# EAGLE design nix3PowerFinal (EAGLE 9.2.2)

## Sheet 1 of 2
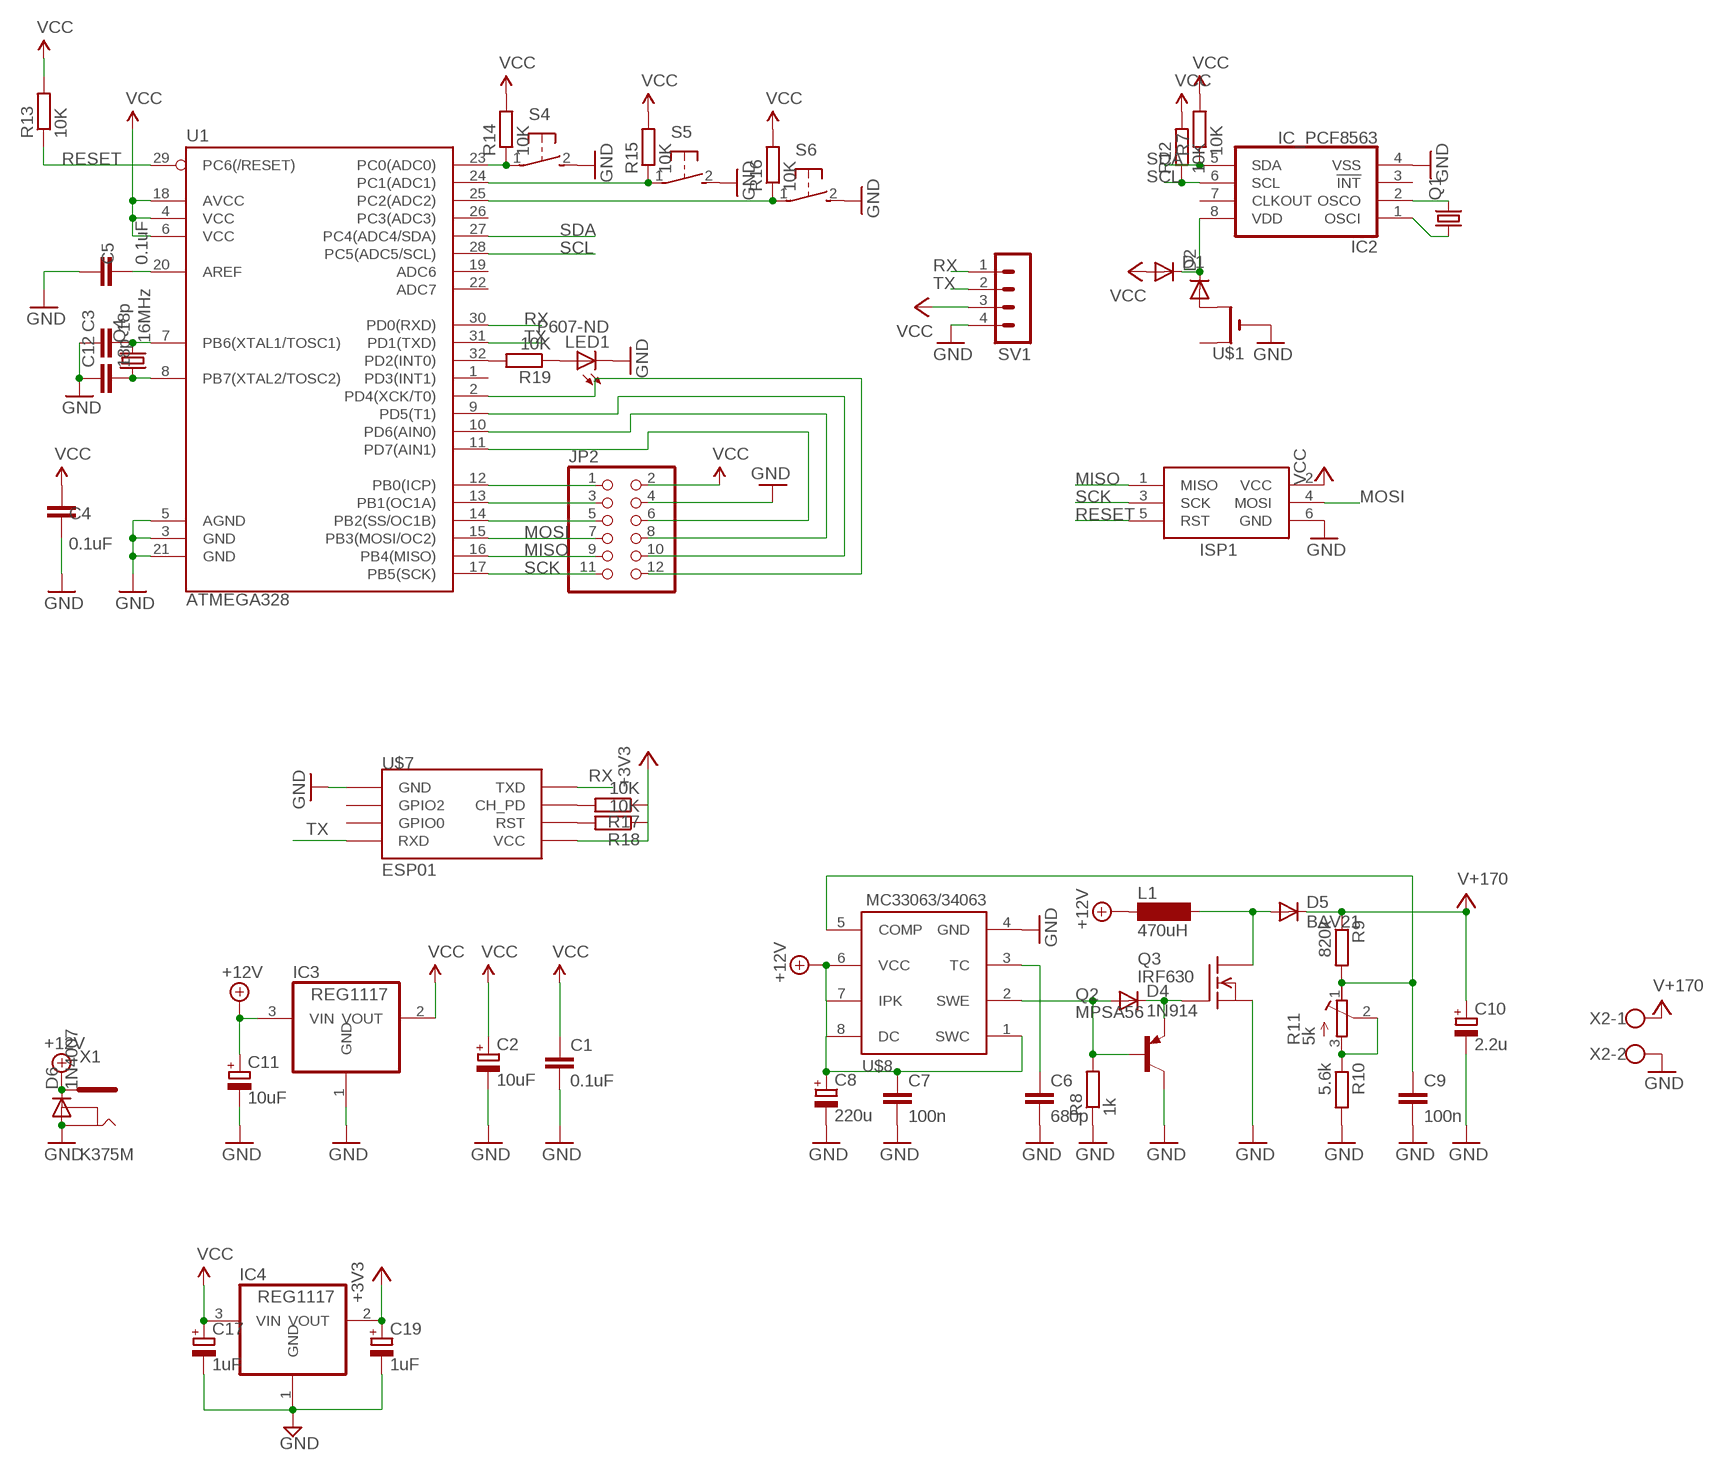
[diagram p0: schematic, sheet 1]

### Parts
C1  0.1uF  C-EUC0805  [C0805]
C2  10uF  CPOL-EUE2.5-5  [E2,5-5]
C3  18p  C-EUC0805  [C0805]
C4  0.1uF  C-EUC0805  [C0805]
C5  0.1uF  C-EUC0805  [C0805]
C6  680p  C-EU050-025X075  [C050-025X075]
C7  100n  C-EU050-025X075  [C050-025X075]
C8  220u  CPOL-EUE3.5-8  [E3,5-8]
C9  100n  C-EU050-025X075  [C050-025X075]
C10  2.2u  CPOL-EUE3.5-8  [E3,5-8]
C11  10uF  CPOL-EUE2.5-5  [E2,5-5]
C12  18p  C-EUC0805  [C0805]
C17  1uF  CPOL-EU153CLV-0505  [153CLV-0505]
C19  1uF  CPOL-EU153CLV-0505  [153CLV-0505]
D1  DIODE-SOD80C  [SOD80C]
D2  DIODE-SOD80C  [SOD80C]
D4  1N914  DIODE-D-5  [D-5]
D5  BAV21  DIODE-D-5  [D-5]
D6  1N4007  DIODE-D-7.5  [D-7.5]
IC2  IC_PCF8563  [SO-8]
IC3  REG1117  [SOT223]
IC4  REG1117  [SOT223]
ISP1  AVRISP-6  [AVRISP]
JP2  PINHD-2X6  [2X06]
L1  470uH  BS11  [BS11]
LED1  P607-ND  LEDB155  [Q62902-B155]
Q1  CRYSTALTC38H  [TC38H]
Q2  MPSA56  [TO92-CBE]
Q3  IRF630  IRF620  [TO220]
Q4  16MHz  CRYSTALHC49U-V  [HC49U-V]
R7  10K  R-EU_R0805  [R0805]
R8  1k  R-EU_0204/5  [0204/5]
R9  820k  R-EU_0204/5  [0204/5]
R10  5.6k  R-EU_0204/5  [0204/5]
R11  5k  R-TRIMM43P  [RTRIM43P]
R12  10K  R-EU_R0805  [R0805]
R13  10K  R-EU_R0805  [R0805]
R14  10K  R-EU_R0805  [R0805]
R15  10K  R-EU_R0805  [R0805]
R16  10K  R-EU_R0805  [R0805]
R17  10K  R-EU_R0805  [R0805]
R18  10K  R-EU_R0805  [R0805]
R19  10K  R-EU_R0805  [R0805]
S4  31-XX  [B3F-31XX]
S5  31-XX  [B3F-31XX]
S6  31-XX  [B3F-31XX]
SV1  MA04-1  [MA04-1]
U1  ATMEGA328  ATMEGA168  [TQFP32-08]
U$1  CR2032THM  [CR2032-THRU]
U$7  ESP01  [ESP01]
U$8  MC33063/MC34063P  [DIL08]
X1  K375M  [K375M]
X2  W237-102  [W237-102]

### Nets
+3V3: C19.+ IC4.2(VOUT) R17.1 R18.1 U$7.VCC
+12V: C7.1 C8.+ C11.+ D6.C IC3.3(VIN) L1.1 U$8.1(SWC) U$8.6(VCC) U$8.7(IPK) U$8.8(DC) X1.1
GND: C1.2 C2.- C3.1 C4.1 C5.2 C6.2 C7.2 C8.- C9.2 C10.- C11.- C12.1 C17.- C19.- D6.A IC2.4(VSS) IC3.1(GND) IC4.1(GND) ISP1.6(GND) JP2.4 LED1.K(C) Q2.C Q3.3(S) R8.1 R10.2 S4.2(S) S5.2(S) S6.2(S) SV1.4 U1.3(GND) U1.5(AGND) U1.21(GND) U$1.- U$7.GND U$8.4(GND) X1.2 X2.2
MISO: ISP1.1(MISO) JP2.9 U1.16(PB4(MISO))
MOSI: ISP1.4(MOSI) JP2.7 U1.15(PB3(MOSI/OC2))
N$1: IC2.2(OSCO) Q1.2
N$2: D2.A U$1.+2(+1)
N$34: C6.1 U$8.3(TC)
N$35: JP2.5 U1.14(PB2(SS/OC1B))
N$36: JP2.3 U1.13(PB1(OC1A))
N$37: JP2.1 U1.12(PB0(ICP))
N$38: IC2.1(OSCI) Q1.1
N$39: D1.C D2.C IC2.8(VDD)
N$41: C3.2 Q4.2 U1.7(PB6(XTAL1/TOSC1))
N$42: C12.2 Q4.1 U1.8(PB7(XTAL2/TOSC2))
N$43: R19.2 U1.32(PD2(INT0))
N$44: LED1.A R19.1
N$45: R17.2 U$7.CH_PD
N$46: R18.2 U$7.RST
N$53: JP2.12 U1.2(PD4(XCK/T0))
N$54: JP2.6 U1.11(PD7(AIN1))
N$55: D4.C Q2.E Q3.1(G)
N$56: D5.A L1.2 Q3.2(D)
N$57: D4.A Q2.B R8.2 U$8.2(SWE)
N$58: C9.1 R9.2 R11.1(A) U$8.5(COMP)
N$59: R10.1 R11.2(S) R11.3(E)
N$68: C5.1 U1.20(AREF)
N$69: JP2.8 U1.10(PD6(AIN0))
N$70: JP2.10 U1.9(PD5(T1))
N$71: R14.1 S4.1(P) U1.23(PC0(ADC0))
N$72: R15.1 S5.1(P) U1.24(PC1(ADC1))
N$73: R16.1 S6.1(P) U1.25(PC2(ADC2))
RESET: ISP1.5(RST) R13.1 U1.29(PC6(/RESET))
RX: SV1.1 U1.30(PD0(RXD)) U$7.TX(TXD)
SCK: ISP1.3(SCK) JP2.11 U1.17(PB5(SCK))
SCL: IC2.6(SCL) R12.1 U1.28(PC5(ADC5/SCL))
SDA: IC2.5(SDA) R7.1 U1.27(PC4(ADC4/SDA))
TX: SV1.2 U1.31(PD1(TXD)) U$7.RX(RXD)
V+: C10.+ D5.C R9.1 X2.1 ; supply symbol labelled V+170
VCC: C1.1 C2.+ C4.2 C17.+ D1.A IC3.2(VOUT) IC4.3(VIN) ISP1.2(VCC) JP2.2 R7.2 R12.2 R13.2 R14.2 R15.2 R16.2 SV1.3 U1.4(VCC) U1.6(VCC) U1.18(AVCC)
Unconnected: IC2.3(!INT) IC2.7(CLKOUT) U1.1(PD3(INT1)) U1.19(ADC6) U1.22(ADC7) U1.26(PC3(ADC3)) U$1.+1(+) U$7.GPIO0 U$7.GPIO2 X1.3

## Sheet 2 of 2

## Library data of the parts
C1 C3 C12 = rcl:C-EU: CAPACITOR, European symbol
C2 C11 C17 C19 = rcl:CPOL-EU: POLARIZED CAPACITOR, European symbol
C4-C7 C9 = resistor:C-EU: CAPACITOR, European symbol
C8 C10 = resistor:CPOL-EU: POLARIZED CAPACITOR, European symbol
D1 D2 D4-D6 = diode:DIODE-: DIODE
IC2 = dp_devices:IC_PCF8563
IC3 IC4 = burr-brown:REG1117: 800mA and 1A Low Dropout (LDO) Positive Regulator 1.8V, 2.5V, 2.85V, 3.3V, 5V, and Adj; MPN: REG1117; OC_FARNELL: 1097566; OC_NEWARK: 14P6981
ISP1 = adafruit:AVRISP: AVR ISP HEADER Standard 6 pin header for AVR programming
JP2 = pinhead:PINHD-2X6: PIN HEADER
L1 = inductor-neosid:BS: INDUCTOR nominal inductance, magnetically screened; OC_FARNELL: unknown; OC_NEWARK: unknown
LED1 = led-igi:LED: LED OSRAM: - CHIPLED LG R971, LG N971, LY N971, LG Q971, LY Q971, LO R971, LY R971 LH N974, LH R974 LS Q976, LO Q976, LY Q976 LO Q996 - Hyper CHIPLED LW Q18S LB Q993, LB Q99A, LB R99A - SideLED LS A670, LO A670, LY A670, LG A670, LP A670 LB A673, LV A673, LT A673, LW A673 LH A674 LY A675 LS A676, LA A676, LO A676, LY A676, LW A676 LS A679, LY A679, LG A679 - Hyper Micro SIDELED® LS Y876, LA Y876, LO Y876, LY Y876 LT Y87S - SmartLED LW L88C, LW L88S LB L89C, LB L89S, LG L890 LS L89K, LO L89K, LY L89K LS L896, LA L896, LO L896, LY L896 - TOPLED LS T670, LO T670, LY T670, LG T670, LP T670 LSG T670, LSP T670, LSY T670, LOP T670, LYG T670 LG T671, LOG T671, LSG T671 LB T673, LV T673, LT T673, LW T673 LH T674 LS T676, LA T676, LO T676, LY T676, LB T676, LH T676, LSB T676, LW T676 LB T67C, LV T67C, LT T67C, LS T67K, LO T67K, LY T67K, LW E67C LS E67B, LA E67B, LO E67B, LY E67B, LB E67C, LV E67C, LT E67C LW T67C LS T679, LY T679, LG T679 LS T770, LO T770, LY T770, LG T770, LP T770 LB T773, LV T773, LT T773, LW T773 LH T774 LS E675, LA E675, LY E675, LS T675 LS T776, LA T776, LO T776, LY T776, LB T776 LHGB T686 LT T68C, LB T68C - Hyper Mini TOPLED® LB M676 - Mini TOPLED Santana® LG M470 LS M47K, LO M47K, LY M47K Source: http://www.osram.convergy.de LUXEON: - LUMILED® LXK2-PW12-R00, LXK2-PW12-S00, LXK2-PW14-U00, LXK2-PW14-V00 LXK2-PM12-R00, LXK2-PM12-S00, LXK2-PM14-U00 LXK2-PE12-Q00, LXK2-PE12-R00, LXK2-PE12-S00, LXK2-PE14-T00, LXK2-PE14-U00 LXK2-PB12-K00, LXK2-PB12-L00, LXK2-PB12-M00, LXK2-PB14-N00, LXK2-PB14-P00, LXK2-PB14-Q00 LXK2-PR12-L00, LXK2-PR12-M00, LXK2-PR14-Q00, LXK2-PR14-R00 LXK2-PD12-Q00, LXK2-PD12-R00, LXK2-PD12-S00 LXK2-PH12-R00, LXK2-PH12-S00 LXK2-PL12-P00, LXK2-PL12-Q00, LXK2-PL12-R00 Source: www.luxeon.com KINGBRIGHT: KA-3528ASYC Source: www.kingbright.com
Q1 = crystal:CRYSTAL: CRYSTAL; OC_FARNELL: unknown; OC_NEWARK: unknown
Q2 = transistor-pnp:MPSA56*: PNP Transistror Source: http://www.fairchildsemi.com/ds/MM/MMBTA56.pdf
Q3 = transistor-fet:IRF620: N-Channel Enhancement MOSFET (HEXFET); 200V; 5,2A; 0,8Ohm
Q4 = crystal:CRYSTAL: CRYSTAL; OC_FARNELL: 1666969; OC_NEWARK: unknown
R7-R10 R12-R19 = resistor:R-EU_: RESISTOR, European symbol
R11 = resistor:R-TRIMM: Trimm resistor
S4-S6 = switch-omron:31-XX: OMRON SWITCH; MPN: B3F-3100; OC_FARNELL: 959704; OC_NEWARK: 36M3582
SV1 = con-lstb:MA04-1: PIN HEADER; OC_FARNELL: unknown; OC_NEWARK: unknown
U1 = SparkFun:ATMEGA168
U$1 = adafruit:CR2032
U$7 = esp8266modules:ESP01: ESP8266 Wifi module 01
U$8 = adafruit:MC33063/MC34063: MC33063 and MC34063 Basic DC/DC converter with internal power-NPN transistor, 100KHz, 1.5A peak switch current. 3-40 input/output.
X1 = con-shallin:K375M: K375M - DC POWER JACK 2.5mm/CENTRAL PIN Source: Data sheet <http://www.shallin.com/productview.aspx?itemnumber=K375M>
X2 = con-wago-500:W237-102: WAGO SCREW CLAMP; MPN: 237-102; OC_FARNELL: unknown; OC_NEWARK: 70K9898

## Board
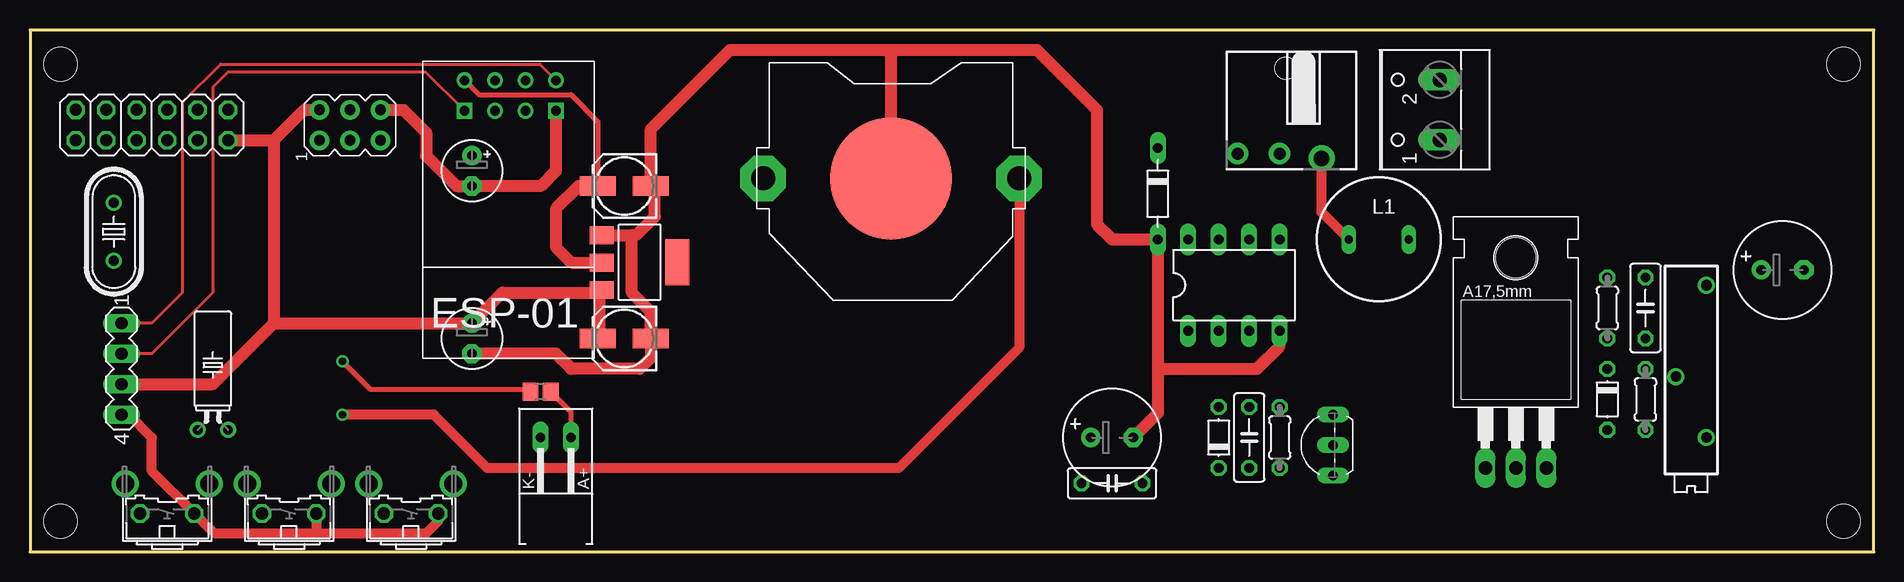
[diagram p1: board, top side]
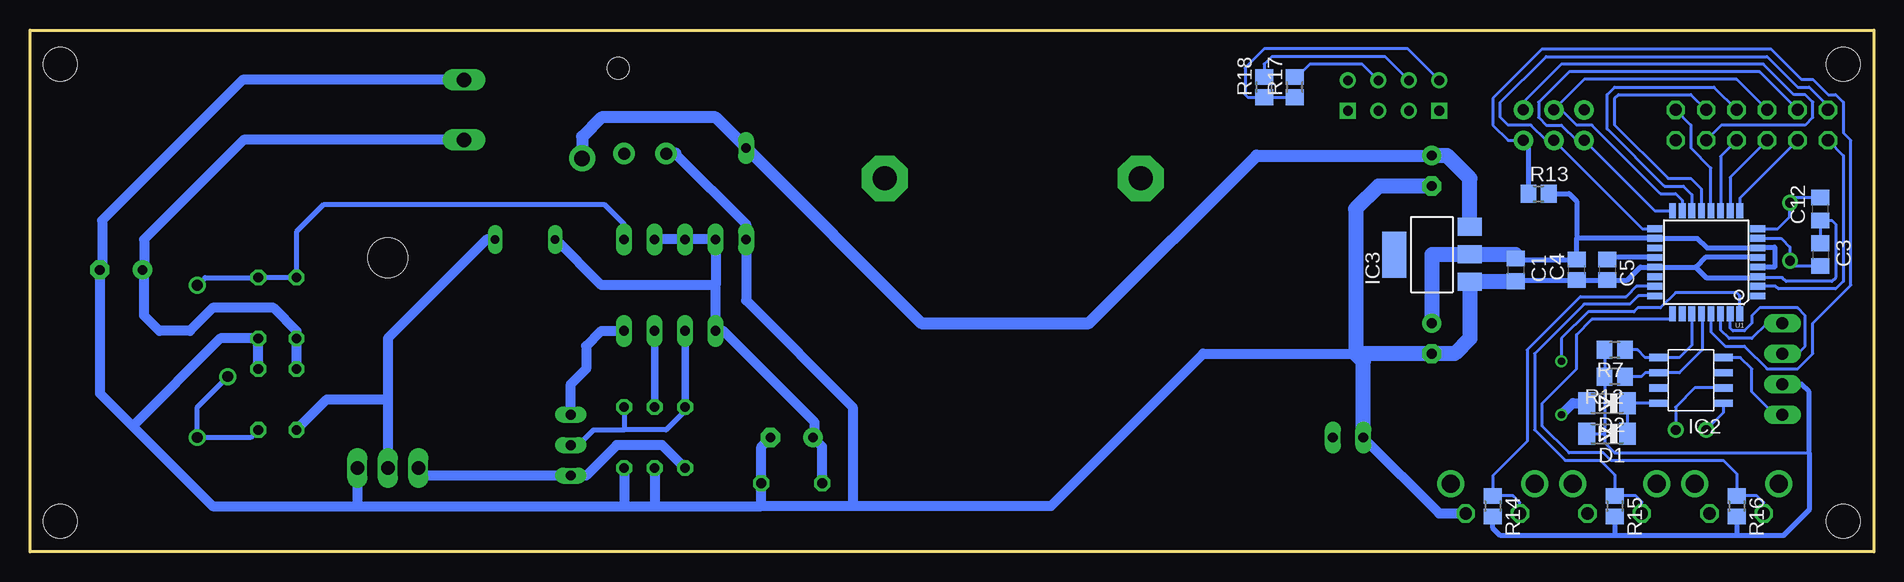
[diagram p2: board, bottom side, seen from below]

Size 153.65 x 43.48 mm. Coordinates in mm from the lower left corner, seen from the top.
Outline: 153.65,43.48 0,43.48 0,0 153.65,0 153.65,43.48
Copper layers (1*16): Top 0.035mm / dielectric 1.5mm / Bottom 0.035mm
Design rules "default *": minimum track width 10mil, minimum drill 0.3mm, track to track 8mil, track to pad 8mil, pad to pad 8mil, via to via 8mil, smd to smd 8mil, copper to edge 40mil, drill to drill 8mil, minimum pad ring 10mil, minimum via ring 8mil, stop-mask expansion 4mil, vias tented up to drill 0mil, thermal gap 10mil
Holes 2.8 mm at 151.13,2.54 151.13,40.64 2.54,40.64 2.54,2.54

### Footprints (pad centres in the part's own frame; a part is rotated, then mirrored left to right if it is on the bottom)
C0805 = smd 1.3 x 1.5: 1 -0.95,0; 2 0.95,0
E2,5-5 = drill 0.813 pad 1.6: + -1.27,0 | drill 0.813 pad 1.6 octagon: - 1.27,0
C0805' = smd 1.3 x 1.5: 1 -0.85,0; 2 0.85,0
C050-025X075 = drill 0.813 octagon: 1 -2.54,0; 2 2.54,0
E3,5-8 = drill 0.813 pad 1.6: + -1.778,0 | drill 0.813 pad 1.6 octagon: - 1.778,0
153CLV-0505 = smd 3 x 1.6: + 2.2,0; - -2.2,0
SOD80C = smd 1.4 x 1.8: A 1.7,0; C -1.7,0
D-5 = drill 0.813 octagon: A 2.54,0; C -2.54,0
D-7.5 = drill 0.813 long: A 3.81,0; C -3.81,0
SO-8 = smd 0.6 x 1.55: 1 -1.905,-2.69; 2 -0.635,-2.69; 3 0.635,-2.69; 4 1.905,-2.69; 5 1.905,2.71; 6 0.635,2.71; 7 -0.635,2.71; 8 -1.905,2.71
SOT223 = smd 1.499 x 2.007: 1 -2.261,-3.15; 2 0.025,-3.15; 3 2.311,-3.15 | smd 3.81 x 2.007: 4 0,3.15
AVRISP = drill 0.9 pad 1.626: 1 -1.27,2.54; 2 1.27,2.54; 3 -1.27,0; 4 1.27,0; 5 -1.27,-2.54; 6 1.27,-2.54
2X06 = drill 1.016 octagon: 1 -6.35,-1.27; 2 -6.35,1.27; 3 -3.81,-1.27; 4 -3.81,1.27; 5 -1.27,-1.27; 6 -1.27,1.27; 7 1.27,-1.27; 8 1.27,1.27; 9 3.81,-1.27; 10 3.81,1.27; 11 6.35,-1.27; 12 6.35,1.27
BS11 = drill 0.7 long: 1 -2.5,0; 2 2.5,0
Q62902-B155 = drill 0.813 long: A 7.62,-1.27; K 7.62,1.27
TC38H = drill 0.813: 1 -1.27,0; 2 1.27,0
TO92-CBE = drill 0.813 long: B 0,0; C 2.54,0; E -2.54,0
TO220 = drill 1.118 long: 1 -2.54,-6.35; 2 0,-6.35; 3 2.54,-6.35 | hole 3.302: 0,11.176
HC49U-V = drill 0.813: 1 -2.413,0; 2 2.413,0
R0805 = smd 1.3 x 1.5: 1 -0.85,0; 2 0.85,0
0204/5 = drill 0.813 octagon: 1 -2.54,0; 2 2.54,0
RTRIM43P = drill 0.9: 1 -7.62,1.27; 2 0,-1.27; 3 5.08,1.27
B3F-31XX = drill 1.016 octagon: 1 -2.261,-1.245; 2 2.261,-1.245 | drill 1.499 pad 2.159: 3 -3.505,1.245; 4 3.505,1.245
MA04-1 = drill 1.016 long: 1 -3.81,0; 2 -1.27,0; 3 1.27,0; 4 3.81,0
TQFP32-08 = smd 1.27 x 0.559: 1 -4.293,2.8; 2 -4.293,2; 3 -4.293,1.2; 4 -4.293,0.4; 5 -4.293,-0.4; 6 -4.293,-1.2; 7 -4.293,-2; 8 -4.293,-2.8; 17 4.293,-2.8; 18 4.293,-2; 19 4.293,-1.2; 20 4.293,-0.4; 21 4.293,0.4; 22 4.293,1.2; 23 4.293,2; 24 4.293,2.8 | smd 0.559 x 1.27: 9 -2.8,-4.293; 10 -2,-4.293; 11 -1.2,-4.293; 12 -0.4,-4.293; 13 0.4,-4.293; 14 1.2,-4.293; 15 2,-4.293; 16 2.8,-4.293; 25 2.8,4.293; 26 2,4.293; 27 1.2,4.293; 28 0.4,4.293; 29 -0.4,4.293; 30 -1.2,4.293; 31 -2,4.293; 32 -2.8,4.293
CR2032-THRU = drill 2 pad 3.81 octagon: +1 -10.668,0; +2 10.668,0 | smd 10.16 x 10.16: - 0,0
ESP01 = drill 0.8: CH_PD -1.285,-8.178; GPIO0 1.255,-5.638; GPIO2 -1.285,-5.638; RST 1.255,-8.178; TX -3.825,-8.178; VCC 3.795,-8.178 | drill 0.8 square: GND -3.825,-5.638; RX 3.795,-5.638
DIL08 = drill 0.813 long: 1 -3.81,-3.81; 2 -1.27,-3.81; 3 1.27,-3.81; 4 3.81,-3.81; 5 3.81,3.81; 6 1.27,3.81; 7 -1.27,3.81; 8 -3.81,3.81
K375M = drill 1.3 pad 2.184: 1 -3.5,1.5 | drill 1 pad 1.8: 2 3.5,1.1; 3 0,1.1 | hole 1.8: -0.5,-6
W237-102 = drill 1.194 long: 1 -2.5,-1.27; 2 2.5,-1.27

### Placement (x,y rotation side)
C1  29.84,23.5 270 bottom
C2  36.83,17.78 270 top
C3  4.45,24.77 270 bottom
C4  0.1uF  [C0805']  24.77,23.5 90 bottom
C5  0.1uF  [C0805']  22.23,23.5 270 bottom
C6  101.6,9.53 270 top
C7  90.17,5.71 0 top
C8  90.17,9.53 0 top
C9  134.62,20.32 270 top
C10  146.05,23.5 0 top
C11  36.83,31.75 270 top
C12  4.45,28.57 90 bottom
C17  49.53,17.78 180 top
C19  49.53,30.48 180 top
D1  22.23,9.84 180 bottom
D2  22.23,12.38 180 bottom
D4  99.06,9.53 90 top
D5  131.44,12.7 270 top
D6  93.98,29.84 270 top
IC2  15.24,14.29 90 bottom
IC3  36.83,24.77 90 bottom
IC4  50.8,24.13 270 top
ISP1  26.67,35.56 90 top
JP2  10.16,35.56 180 top
L1  112.39,26.04 0 top
LED1  43.81,1.91 90 top
Q1  15.24,10.16 0 top
Q2  108.58,8.89 90 top
Q3  123.83,13.34 0 top
Q4  6.99,26.67 270 top
R7  21.59,16.83 180 bottom
R8  104.14,9.53 90 top
R9  131.44,20.32 90 top
R10  134.62,12.7 90 top
R11  138.43,14.61 270 top
R12  21.59,14.61 180 bottom
R13  27.94,29.84 0 bottom
R14  31.75,3.81 270 bottom
R15  21.59,3.81 270 bottom
R16  11.43,3.81 270 bottom
R17  48.26,38.73 90 bottom
R18  50.8,38.73 90 bottom
R19  42.55,13.34 180 top
S4  31.75,4.45 0 top
S5  21.59,4.45 0 top
S6  11.43,4.45 0 top
SV1  7.62,15.24 270 top
U1  13.97,24.13 180 bottom
U$1  71.75,31.11 0 top
U$7  40.01,31.11 180 top
U$8  100.33,22.23 0 top
X1  104.14,34.29 180 top
X2  116.2,36.83 90 top

### Tracks (layer width: path | path; a pad name or v marks a point on that pad's centre or on a via)
+3V3
  Top 0.406: U$7.VCC 37.4,38.1 45.09,38.1 47.33,35.85 C19.+
  Top 1.016: C19.+ 45.72,30.48 43.81,28.57 43.81,25.4 45.11,24.11 IC4.2
  Bottom 0.254: R17.1 R18.1 52.17,37.88 52.39,38.1 52.39,40.32 50.8,41.91 38.83,41.91 U$7.VCC
+12V
  Top 0.813: L1.1 107.64,28.29 X1.1
  Bottom 0.813: U$8.6 U$8.7 U$8.8 96.52,22.23 | 96.52,22.23 106.05,22.23 109.86,26.04 L1.1 | 96.52,22.23 U$8.1 95.89,18.41 88.27,10.79 88.27,9.65 C8.+ 87.63,8.76 C7.1
  Bottom 1.016: C11.+ 51.44,33.02 65.41,19.05 79.38,19.05 D6.C 96.52,36.2 106.05,36.2 107.64,34.6 X1.1
  Bottom 1.27: IC3.3 33.66,27.08 33.66,31.11 35.56,33.02 C11.+
GND
  Top 0.813: SV1.4 8.26,11.43 10.16,9.53 10.16,6.73 S6.2 15.34,1.55 24.13,1.55 | 24.13,1.55 33.02,1.55 34.01,2.54 S4.2 | S5.2 23.85,1.83 24.13,1.55
  Top 1.016: ISP1.6 31.11,36.83 33.02,34.92 33.02,33.02 35.56,30.48 C11.- 42.55,30.48 43.81,31.75 43.81,36.74 U$7.GND | IC4.1 50.16,26.39 | 50.16,26.39 50.52,26.39 52.07,27.94 52.07,30.18 C19.- 51.73,35.22 58.34,41.83 71.75,41.83 | 50.16,26.39 50.16,21.59 51.73,20.02 C17.- 51.73,16.17 50.8,15.24 45.09,15.24 43.81,16.51 C2.- | 93.98,15.24 D6.A 90.17,26.04 88.9,27.3 88.9,36.83 83.9,41.83 71.75,41.83 | 93.98,15.24 93.98,11.56 C8.- | 93.98,15.24 102.23,15.24 104.14,17.14 U$8.4 | U$1.- 71.75,41.83
  Bottom 0.254: JP2.4 12.7,35.56 5.71,35.56 5.08,36.2 5.08,37.47 5.71,38.1 6.67,38.1 9.21,40.64 26.04,40.64 29.21,37.47 ISP1.6 | C3.1 C12.1 3.5,27.62 3.17,27.3 3.17,22.86 3.49,22.54 7.3,22.54 7.62,22.86 9.61,22.86 U1.3 | SV1.4 8.26,11.43 10.16,13.34 10.16,15.24 11.11,16.19 IC2.4
  Bottom 0.406: C1.2 29.75,22.64 C4.1 C5.2 20.54,22.64 19.45,23.73 U1.21 14.84,23.73 | 14.84,23.73 13.97,22.86 9.75,22.86 U1.3 | U1.5 14.04,24.53 14.84,23.73
  Bottom 0.813: 145.1,10.48 147.83,13.21 C10.- 147.64,23.69 147.64,27.62 135.93,39.33 X2.2 | 145.1,10.48 138.43,3.81 126.36,3.81 | Q3.3 126.36,3.81 | 126.36,3.81 104.14,3.81 | 104.14,3.81 101.6,3.81 | 101.6,3.81 92.71,3.81 | 85.09,3.81 68.58,3.81 55.88,16.51 43.18,16.51 | 85.09,3.81 92.71,3.81 | 92.71,3.81 C7.2 92.71,8.76 C8.- | 99.86,33.19 93.98,27.3 D6.A 93.98,20.95 85.09,12.06 85.09,3.81 | Q2.C 108.58,13.97 107.31,15.24 107.31,17.14 106.05,18.41 U$8.4 | C6.2 101.6,3.81 | R8.1 104.14,3.81 | R10.2 C9.2 137.79,17.78 145.1,10.48 | LED1.K 36.22,3.2 S4.2
  Bottom 1.016: X1.2 99.86,33.19
  Bottom 1.27: C1.2 33.64,22.55 IC3.1 33.66,22.48 33.66,17.78 34.92,16.51 C2.- 43.18,16.51 | C11.- 41.27,30.48 43.18,28.57 43.18,16.51 | LED1.K 42.55,15.88 43.18,16.51
MISO
  Bottom 0.254: JP2.9 9.53,40.01 25.4,40.01 27.94,37.47 27.94,36.2 27.3,35.56 26.04,35.56 24.77,34.29 ISP1.1 18.26,28.42 U1.16
MOSI
  Bottom 0.254: JP2.7 11.43,39.37 24.13,39.37 ISP1.4 26.04,36.83 24.77,35.56 23.5,35.56 17.78,29.84 16.51,29.84 15.97,29.3 U1.15
N$1
  Bottom 0.254: IC2.2 14.92,13.65 16.51,12.06 Q1.2
N$2  (via drill 0.61)
  Top 0.813: U$1.+2 82.42,17.02 72.39,6.99 38.1,6.99 33.66,11.43 v26.04,11.43
  Bottom 0.813: v26.04,11.43 25.08,12.38 D2.A
N$34
  Bottom 0.61: C6.1 U$8.3
N$35
  Bottom 0.254: JP2.5 13.34,38.73 21.59,38.73 22.23,38.1 22.23,35.24 17.46,30.48 15.88,30.48 15.17,29.77 U1.14
N$36
  Bottom 0.254: JP2.3 15.24,38.1 21.27,38.1 21.59,37.78 21.59,35.56 17.14,31.11 15.24,31.11 14.37,30.25 U1.13
N$37
  Bottom 0.254: JP2.1 15.24,35.56 15.24,33.66 13.57,31.98 U1.12
N$38
  Bottom 0.254: IC2.1 12.55,11.58 Q1.1
N$39
  Bottom 0.254: IC2.8 D2.C D1.C
N$41
  Bottom 0.254: U1.7 7.71,26.13 6.99,25.4 Q4.2 6.54,23.82 C3.2
N$42
  Bottom 0.254: U1.8 8,26.93 6.99,27.94 Q4.1 6.54,29.52 C12.2
N$43  (via drill 0.61)
  Top 0.406: R19.2 41.48,13.55 28.36,13.55 v26.04,15.88
  Bottom 0.254: U1.32 11.17,21.33 11.43,21.59 16.51,21.59 17.78,20.32 19.68,20.32 20,20 23.81,20 26.04,17.78 v26.04,15.88
N$44
  Top 0.406: LED1.A 45.09,11.64 R19.1
N$45
  Bottom 0.254: U$7.CH_PD 42.64,40.64 46.99,40.64 48.05,39.59 R17.2
N$46
  Bottom 0.254: U$7.RST 40.73,41.27 50.16,41.27 50.8,40.64 R18.2
N$53
  Bottom 0.254: JP2.12 2.54,33.02 2.54,22.54 3.17,21.91 7.94,21.91 8.16,22.13 U1.2
N$54
  Bottom 0.254: JP2.6 12.77,32.95 U1.11
N$55
  Bottom 0.813: D4.C 100.97,8.89 104.78,8.89 107.31,6.35 Q2.E 120.65,6.35 Q3.1
N$56
  Bottom 0.813: L1.2 115.57,26.04 123.83,17.78 123.83,12.7 | 123.83,12.7 Q3.2 | D5.A 128.91,12.7 123.83,12.7
N$57
  Bottom 0.406: D4.A 99.06,11.75 100.65,10.16 104.14,10.16 | R8.2 104.14,10.16 | Q2.B 107.95,8.89 106.68,10.16 104.14,10.16
  Bottom 0.61: D4.A U$8.2
N$58
  Bottom 0.406: R11.1 139.06,22.86 C9.1 R9.2 131.44,26.67 129.21,28.91 105.74,28.91 104.14,27.3 U$8.5
N$59
  Bottom 0.406: R10.1 135.25,9.53 R11.3 139.7,12.06 R11.2
N$68
  Bottom 0.254: 22.04,24.53 arc-90 C5.1
  Bottom 0.406: U1.20 22.04,24.53 arc-90 C5.1
N$69
  Bottom 0.254: JP2.8 11.97,31.21 U1.10
N$70
  Bottom 0.254: JP2.10 11.17,29.47 U1.9
N$71
  Bottom 0.254: U1.23 19.78,22.13 20.64,21.27 24.45,21.27 28.89,16.83 28.89,9.21 31.75,6.35 R14.1 30.06,4.66 29.49,4.09 S4.1
N$72
  Bottom 0.254: U1.24 19.63,21.33 20.32,20.64 24.13,20.64 28.26,16.51 28.26,10.16 25.72,7.62 22.8,7.62 21.59,6.41 R15.1 19.84,4.66 19.33,4.15 S5.1
N$73
  Bottom 0.254: U1.25 16.77,19.43 16.83,19.37 23.5,19.37 24.77,18.1 24.77,15.24 27.62,12.38 27.62,10.48 25.4,8.26 22.54,8.26 21.91,7.62 12.54,7.62 11.43,6.51 R16.1 9.74,4.66 9.17,4.09 S6.1
RESET
  Bottom 0.254: U1.29 13.57,18.33 12.38,17.14 10.79,17.14 8.89,15.24 6.35,15.24 5.08,16.51 5.08,19.05 1.91,22.23 1.91,34.29 2.54,34.92 2.54,37.47 3.17,38.1 3.81,38.1 5.08,39.37 6.03,39.37 8.57,41.91 27.62,41.91 31.75,37.78 31.75,35.56 30.48,34.29 ISP1.5
  Bottom 0.406: ISP1.5 28.79,33.87 R13.1
RX
  Top 0.254: U$7.TX 42.48,40.64 15.88,40.64 12.7,37.47 12.7,21.59 10.16,19.05 SV1.1
  Bottom 0.254: SV1.1 8.89,19.05 10.16,17.78 12.06,17.78 12.77,18.48 U1.30
SCK
  Bottom 0.254: U1.17 19.31,26.93 ISP1.3 27.3,34.29 28.57,35.56 30.48,35.56 31.11,36.2 31.11,37.47 27.3,41.27 8.89,41.27 6.35,38.73 5.4,38.73 3.81,37.15 JP2.11
SCL
  Bottom 0.254: U1.28 14.29,19.75 14.29,16.83 16.19,14.92 IC2.6 19.05,14.92 19.37,14.61 R12.1
SDA
  Bottom 0.254: U1.27 15.17,17.21 16.19,16.19 IC2.5 19.05,16.19 19.68,16.83 R7.1
TX
  Top 0.254: U$7.RX 32.96,40.01 16.51,40.01 15.24,38.73 15.24,21.59 10.16,16.51 SV1.2
  Bottom 0.254: SV1.2 6.35,16.51 5.71,17.14 5.71,19.68 6.35,20.32 9.53,20.32 10.16,19.68 10.16,19.05 10.79,18.41 11.75,18.41 11.97,18.64 U1.31
V+
  Bottom 0.813: X2.1 135.85,34.33 144.15,26.04 144.15,23.62 C10.+ 144.15,23.37 144.15,19.68 142.88,18.41 140.34,18.41 138.43,20.32 133.35,20.32 131.44,18.41 R9.1 D5.C
VCC
  Top 1.016: 20.32,19.05 C2.+ 39.37,21.59 47.42,21.59 | 47.42,21.59 IC4.3 | 47.42,21.59 47.42,17.87 C17.+ | SV1.3 15.24,13.97 20.32,19.05 | ISP1.2 22.86,36.83 20.32,34.29 | JP2.2 20.32,34.29 | 20.32,34.29 20.32,19.05
  Bottom 0.254: R7.2 R12.2 22.44,9.84 | 5.4,8.26 21.59,8.26 22.44,9.11 22.44,9.84 | D1.A 22.44,9.84
  Bottom 0.406: C1.1 29.75,24.34 C4.2 24.77,26.13 | 24.77,26.13 U1.18 14.7,26.13 13.9,25.33 U1.6 9.61,25.4 8.26,25.4 8.26,23.73 U1.4 | R13.2 25.4,29.84 24.77,29.21 24.77,26.13 | SV1.3 6.03,13.97 5.4,13.34 5.4,8.26 5.4,3.49 7.54,1.35 11.43,1.35 | 11.43,1.35 21.59,1.35 | 21.59,1.35 31.11,1.35 31.75,1.98 R14.2 | R15.2 21.59,1.35 | R16.2 11.43,1.35
  Bottom 1.27: C2.+ 36.83,24.77 33.71,24.77 IC3.2 29.84,24.79 C1.1